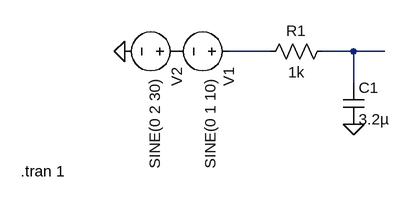
[diagram p0: schematic ex2.asc]
ex2.asc, the LTspice schematic file:
Version 4
SHEET 1 880 680
WIRE 112 -32 48 -32
WIRE 240 -32 192 -32
WIRE 288 -32 240 -32
WIRE 240 16 240 -32
FLAG -112 -32 0
FLAG 240 80 0
SYMBOL voltage 64 -32 R90
WINDOW 123 0 0 Left 0
WINDOW 39 0 0 Left 0
WINDOW 3 41 44 Left 2
SYMATTR Value SINE(0 1 10)
SYMATTR InstName V1
SYMBOL voltage -16 -32 R90
WINDOW 123 0 0 Left 0
WINDOW 39 0 0 Left 0
WINDOW 3 41 50 Left 2
SYMATTR Value SINE(0 2 30)
SYMATTR InstName V2
SYMBOL res 208 -48 R90
WINDOW 0 0 56 VBottom 2
WINDOW 3 32 56 VTop 2
SYMATTR InstName R1
SYMATTR Value 1k
SYMBOL cap 224 16 R0
SYMATTR InstName C1
SYMATTR Value 3.2µ
TEXT -272 152 Left 2 !.tran 1

The netlist it stands for:
* ex2.asc
V1 N001 P001 SINE(0 1 10)
V2 P001 0 SINE(0 2 30)
R1 N002 N001 1k
C1 N002 0 3.2µ
.tran 1
.backanno
.end